# Altium schematic sheet CAN.SchDoc: Наименование
size 420 x 297 mm; ApprovedBy: Утвердил; CheckedBy: Проверил; Author: Разработал; CompanyName: Тесла Тек; DrawnBy: Н.Контр; Engineer: Т.Контр; SheetNumber: 1; SheetTotal: 1; PageSetup: Record=PageOptions|CenterHorizontal=True|CenterVertical=True|PrintScale=0.94|XCorrection=1.00|YCorrection=1.00|PrintKind=1|BorderSize=5000000|LeftOffset=0|BottomOffset=0|Orientation=1|PaperLength=1000|PaperWidth=1000|Scale=100|PaperSource=7|PrintQuality=-4|MediaType=1|DitherType=10|PaperKind=A4|PrintScaleMode=1; DecimalNumber: Децимальный номер; HeadOfSector: Нач. сектора; MainDevice: Перв.примен.; Name: Наименование; Обозначение документа: TT.005.001.001 ЭЗ; Номер листа: 2; DocumentName: Sheet1.SCHDOC
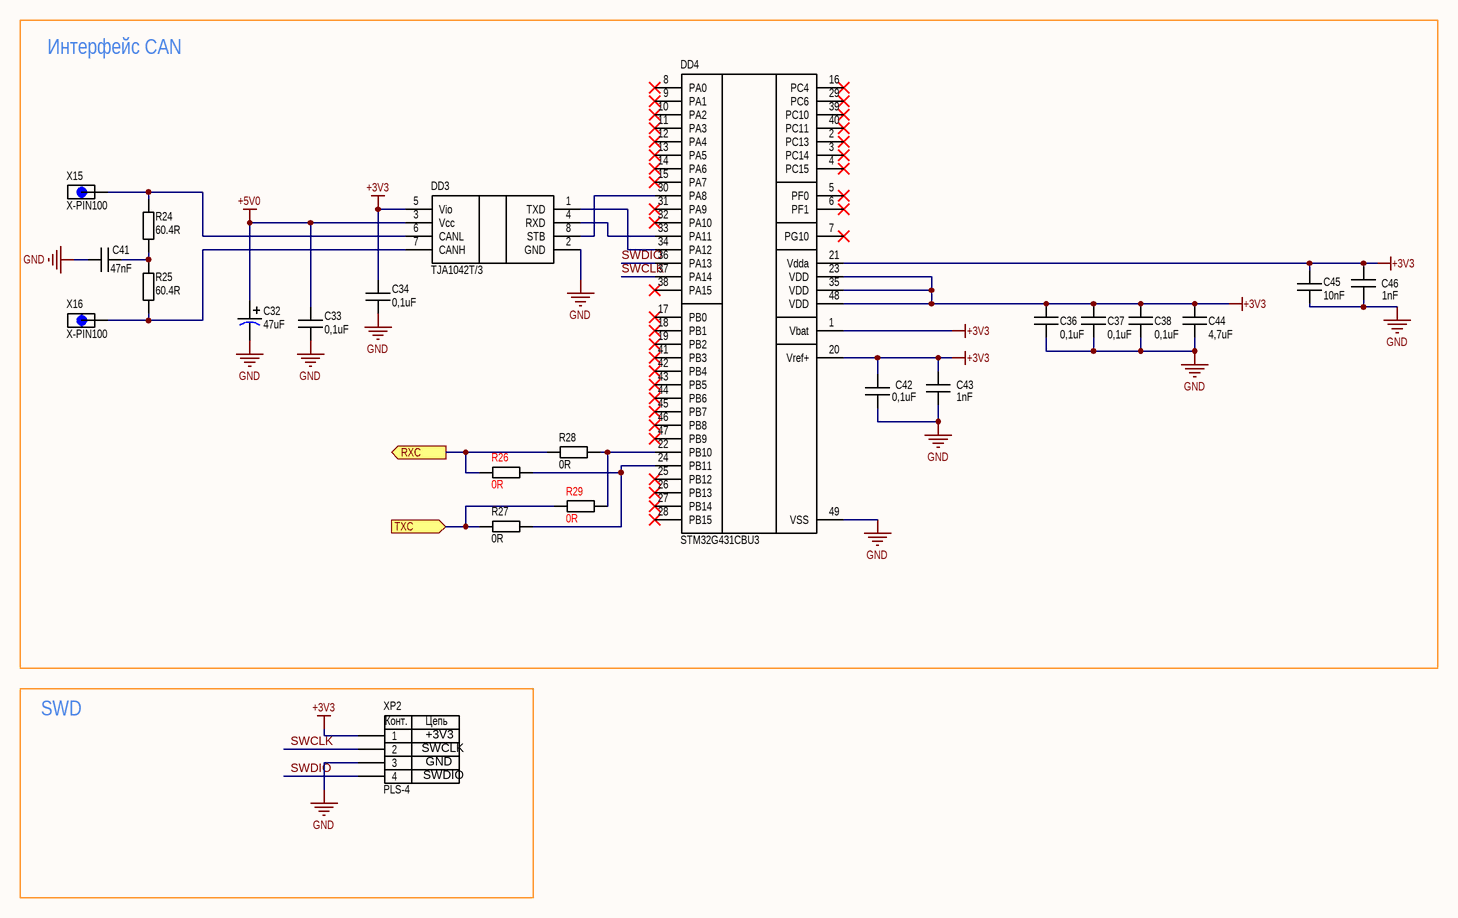
[diagram p0: CAN.SchDoc]

## Parts
C32  47uF  [B1411_3528]
C33  0,1uF  [0805C]
C34  0,1uF  [0805C]
C36  0,1uF  [0805C]
C37  0,1uF  [0805C]
C38  0,1uF  [0805C]
C41  47nF  [0805C]
C42  0,1uF  [0805C]
C43  1nF  [0805C]
C44  4,7uF  [0805C]
C45  10nF  [0805C]
C46  1nF  [0805C]
DD3  TJA1042T/3  [SOIC-8]
DD4  STM32G431CBU3  [TQFP-64]
R24  60.4R  [R0805]
R25  60.4R  [R0805]
R26  0R  [R1206]
R27  0R  [R1206]
R28  0R  [R1206]
R29  0R  [R1206]
X15  X-PIN100  [Xpin100]
X16  X-PIN100  [Xpin100]
XP2  PLS-4  [PLS-4]

## Blocks framed on the sheet
Интерфейс CAN: C32-C34 C36-C38 C41-C46 DD3 DD4 R24-R29 X15 X16
SWD: XP2

## Ports
RXC (out), TXC (in)

## Nets
+3V3: C34.1 C36.1 C37.1 C38.1 C42.1 C43.1 C44.1 C45.1 C46.1 DD3.5(Vio) DD4.1(Vbat) DD4.20(Vref+) DD4.21(Vdda) DD4.23(VDD) DD4.35(VDD) DD4.48(VDD) XP2.1
+5V0: C32.1 C33.1 DD3.3(Vcc)
GND: C32.2 C33.2 C34.2 C36.2 C37.2 C38.2 C41.1 C42.2 C43.2 C44.2 C45.2 C46.2 DD3.2(GND) DD4.49(VSS) XP2.3
RXC: R26.2 R28.2 ; port RXC
SWCLK: DD4.37(PA14) XP2.2
SWDIO: DD4.36(PA13) XP2.4
TXC: R27.2 R29.2 ; port TXC
NetC41_2: C41.2 R24.1 R25.2
NetDD3_1: DD3.1(TXD) DD4.34(PA12)
NetDD3_4: DD3.4(RXD) DD4.33(PA11)
NetDD3_6: DD3.6(CANL) R24.2 X15.1
NetDD3_7: DD3.7(CANH) R25.1 X16.1
NetDD3_8: DD3.8(STB) DD4.30(PA8)
NetDD4_22: DD4.22(PB10) R28.1 R29.1
NetDD4_24: DD4.24(PB11) R26.1 R27.1

Not connected (* = marked no-connect by the designer): DD4 2(PC13)* 3(PC14)* 4(PC15)* 5(PF0)* 6(PF1)* 7(PG10)* 8(PA0)* 9(PA1)* 10(PA2)* 11(PA3)* 12(PA4)* 13(PA5)* 14(PA6)* 15(PA7)* 16(PC4)* 17(PB0)* 18(PB1)* 19(PB2)* 25(PB12)* 26(PB13)* 27(PB14)* 28(PB15)* 29(PC6)* 31(PA9)* 32(PA10)* 38(PA15)* 39(PC10)* 40(PC11)* 41(PB3)* 42(PB4)* 43(PB5)* 44(PB6)* 45(PB7)* 46(PB8)* 47(PB9)*

## Notes on the sheet
- (near XP2) SWCLK
- (near XP2) +3V3
- (near XP2) GND
- (near XP2) SWDIO
- Подп. и дата
- Инв. № дубл.
- Взам. инв. №
- Инв. № подл.
- Изм.
- Лист
- № докум.
- Подп.
- Дата
- Копировал
- Формат А3
- (in symbol PLS-4) Конт.; Цепь

## Library data of the parts
C32 = CP1411B-47UF: CP1411B 47UF 6V3; Part Number: SMD CAP TANTAL 47uF ±10% 6V3 1411B; Added_by: ridel_av@teslatec.ru; Pkg: 1411B; Solder_Amount: 2; Created_at: 21/04/2025; Mount: MOUNT; MountType: SMD
C33 C34 C36-C38 C42 = C0805-0,1uF: C0805 0,1uF; Part Number: SMD CAP CER 0.1uF ±10% 25V X7R 0805; Added_by: ridel_av@teslatec.ru; Pkg: 0805; Solder_Amount: 2; Created_at: 21/04/2025; Mount: MOUNT; MountType: SMD
C41 = C0805-47nF: C0805 47nF 50V; Part Number: SMD CAP CER 47nF ±10% 25V C0G 0805; Added_by: ridel_av@teslatec.ru; Pkg: 0805; Solder_Amount: 2; Created_at: 21/04/2025; Mount: MOUNT; MountType: SMD
C43 C46 = C0805-1nF: C0805 1nF; Part Number: SMD CAP CER 1nF ±10% 50V X7R 0805; Added_by: ridel_av@teslatec.ru; Pkg: 0805; Solder_Amount: 2; Created_at: 21/04/2025; Mount: MOUNT; MountType: SMD
C44 = C0805-4,7uF: C0805 4,7uF 50V; Part Number: SMD CAP CER 4.7uF ±10% 50V X7R 0805; Added_by: ridel_av@teslatec.ru; Pkg: 0805; Solder_Amount: 2; Created_at: 21/04/2025; Mount: MOUNT; MountType: SMD
C45 = C0805-10nF: C0805 10nF; Part Number: SMD CAP CER 10nF ±10% 50V X7R 0805; Added_by: ridel_av@teslatec.ru; Pkg: 0805; Solder_Amount: 2; Created_at: 21/04/2025; Mount: MOUNT; MountType: SMD
DD3 = TJA1042T/3: High-speed CAN transceiver with Standby mode; Added_by: dolgopolova_ia@teslatec.ru; Solder_Amount: 8; Created_at: 03/09/2025; Mount: MOUNT; MountType: SMD; Part Number: TJA1042T/3; Pkg: SOIC-8
DD4 = STM32G431CBU3: Arm Cortex-M4 32b MCU+FPU, 170 MHz / 213 DMIPS, 128 KB Flash; Added_by: ridel_av@teslatec.ru; Pkg: UFQFPN-48; Solder_Amount: 49; Created_at: 21/04/2025; Mount: MOUNT; MountType: SMD; Part Number: STM32G431CBU3
R24 R25 = R0805-60.4R: R0805 SMD 60.4R OHM 1% ±100ppm/°C; Part Number: SMD RES 60.4 OHM 1% ±100ppm/°C 0805; Added_by: ridel_av@teslatec.ru; Pkg: 0805; Solder_Amount: 2; Created_at: 21/04/2025; Mount: MOUNT; MountType: SMD
R26-R29 = R1206-0R: Part Number: SMD RES 0 OHM 1% ±100ppm/°C 1206; Added_by: ridel_av@teslatec.ru; Pkg: 1206; Solder_Amount: 2; Created_at: 21/04/2025; Mount: MOUNT; MountType: SMD
X15 X16 = X-PIN100: Added_by: ridel_av@teslatec.ru; Solder_Amount: 2; Created_at: 21/04/2025; Mount: MOUNT; MountType: SMD
XP2 = PLS-4: HEADER 2.54mm; Mating Part: BLS-4; Added_by: irdolgopolowa@yandex.ru; Solder_Amount: 4; Mating Terminals: BL-T (DS-1071); Cable/Wire: МГТФ 0,35 кв.мм ГОСТ; Created_at: 29/10/24; Mount: MOUNT; MountType: THM; Part Number: PLS-4; Pkg: PLS-4